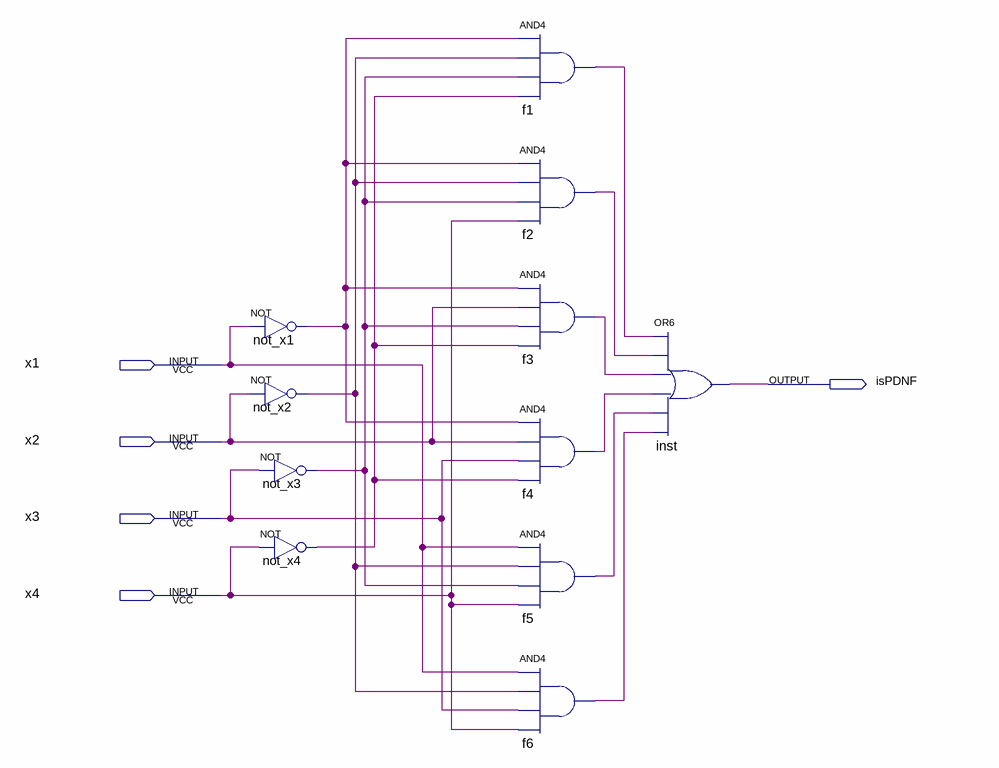
[diagram p0: schematic sheet]
// Quartus schematic PDNF_scheme.bdf as structural Verilog: 11 symbols, 5 pins
module PDNF_scheme (
  input  x1,
  input  x2,
  input  x3,
  input  x4,
  output isPDNF
);

  wire f1_out, f2_out, f3_out, f4_out, f5_out, f6_out, not_x1_out, not_x2_out, not_x3_out, not_x4_out;

  not not_x1 (not_x1_out, x1);
  not not_x2 (not_x2_out, x2);
  not not_x3 (not_x3_out, x3);
  not not_x4 (not_x4_out, x4);
  and f1 (f1_out, not_x1_out, not_x2_out, not_x3_out, not_x4_out);
  and f2 (f2_out, not_x1_out, not_x2_out, not_x3_out, x4);
  and f3 (f3_out, not_x1_out, x2, not_x3_out, not_x4_out);
  and f4 (f4_out, not_x1_out, x2, x3, not_x4_out);
  and f5 (f5_out, x1, not_x2_out, not_x3_out, x4);
  and f6 (f6_out, x1, not_x2_out, x3, x4);
  or inst (isPDNF, f1_out, f2_out, f3_out, f4_out, f5_out, f6_out);
endmodule
